# Altium schematic sheet Pack switch.SchDoc
size A4
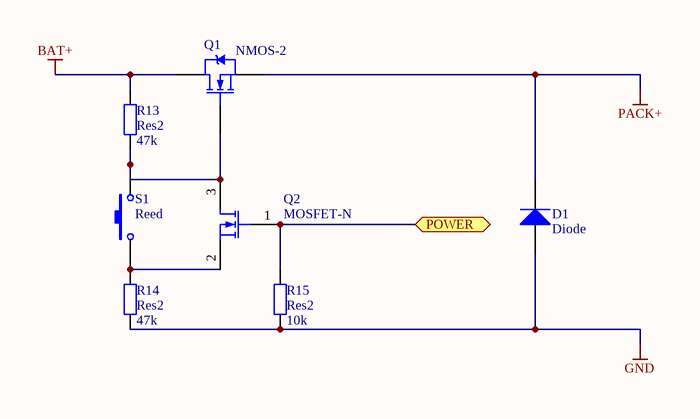
[diagram p0: Pack switch.SchDoc]

## Parts
D1  Diode  [SMC]
Q1  NMOS-2  [TO_263]
Q2  MOSFET-N  [2N7002]
R13  Res2  value 47k  [0603]
R14  Res2  value 47k  [0603]
R15  Res2  value 10k  [0603]
S1  Reed  [SPST-2]

## Ports
POWER

## Nets
BAT+: Q1.2(D) R13.2
GND: D1.1(A) R14.1 R15.1
PACK+: D1.2(K) Q1.3(S)
POWER: Q2.1(G) R15.2 ; port POWER
NetQ1_1: Q1.1(G) Q2.3(D) R13.1 S1.2
NetQ2_2: Q2.2(S) R14.2 S1.1

## Library data of the parts
D1 = Diode: Default Diode; part: multicomp s3k; farnell: 1625204rl
Q1 = NMOS-2: N-Channel Power MOSFET; part: sum110p04-05-e3; farnell: 1839011
Q2 = 2N7002: NXP - 2N7002 - MOSFET,N CH, 60V,0.3A,SOT23; farnell: 1510761
R13-R15 = Res2: Resistor; Published: 8-Jun-2000; LatestRevisionDate: 17-Jul-2002; LatestRevisionNote: Re-released for DXP Platform.; PackageReference: AXIAL-0.4; Publisher: Altium Limited; PackageDescription: Axial Device, Thru-Hole; 2 Leads; 0.4 in Pin Spacing
S1 = SW-PB: Switch; part: hamlim 59025-4-s-02-a; Farnell: 5540690